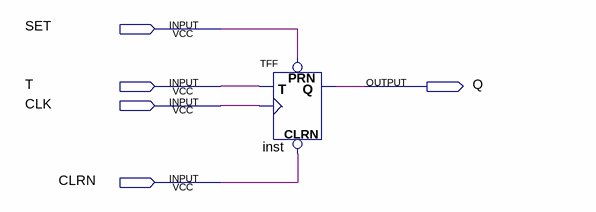
[diagram p0: schematic sheet]
// Quartus schematic Question6.bdf as structural Verilog: 1 symbols, 5 pins
module Question6 (
  input  SET,
  input  T,
  input  CLK,
  input  CLRN,
  output Q
);

  TFF inst (.PRN(SET), .CLRN(CLRN), .T(T), .CLK(CLK), .Q(Q));
endmodule
